# EAGLE design combined (EAGLE 6.6.0)
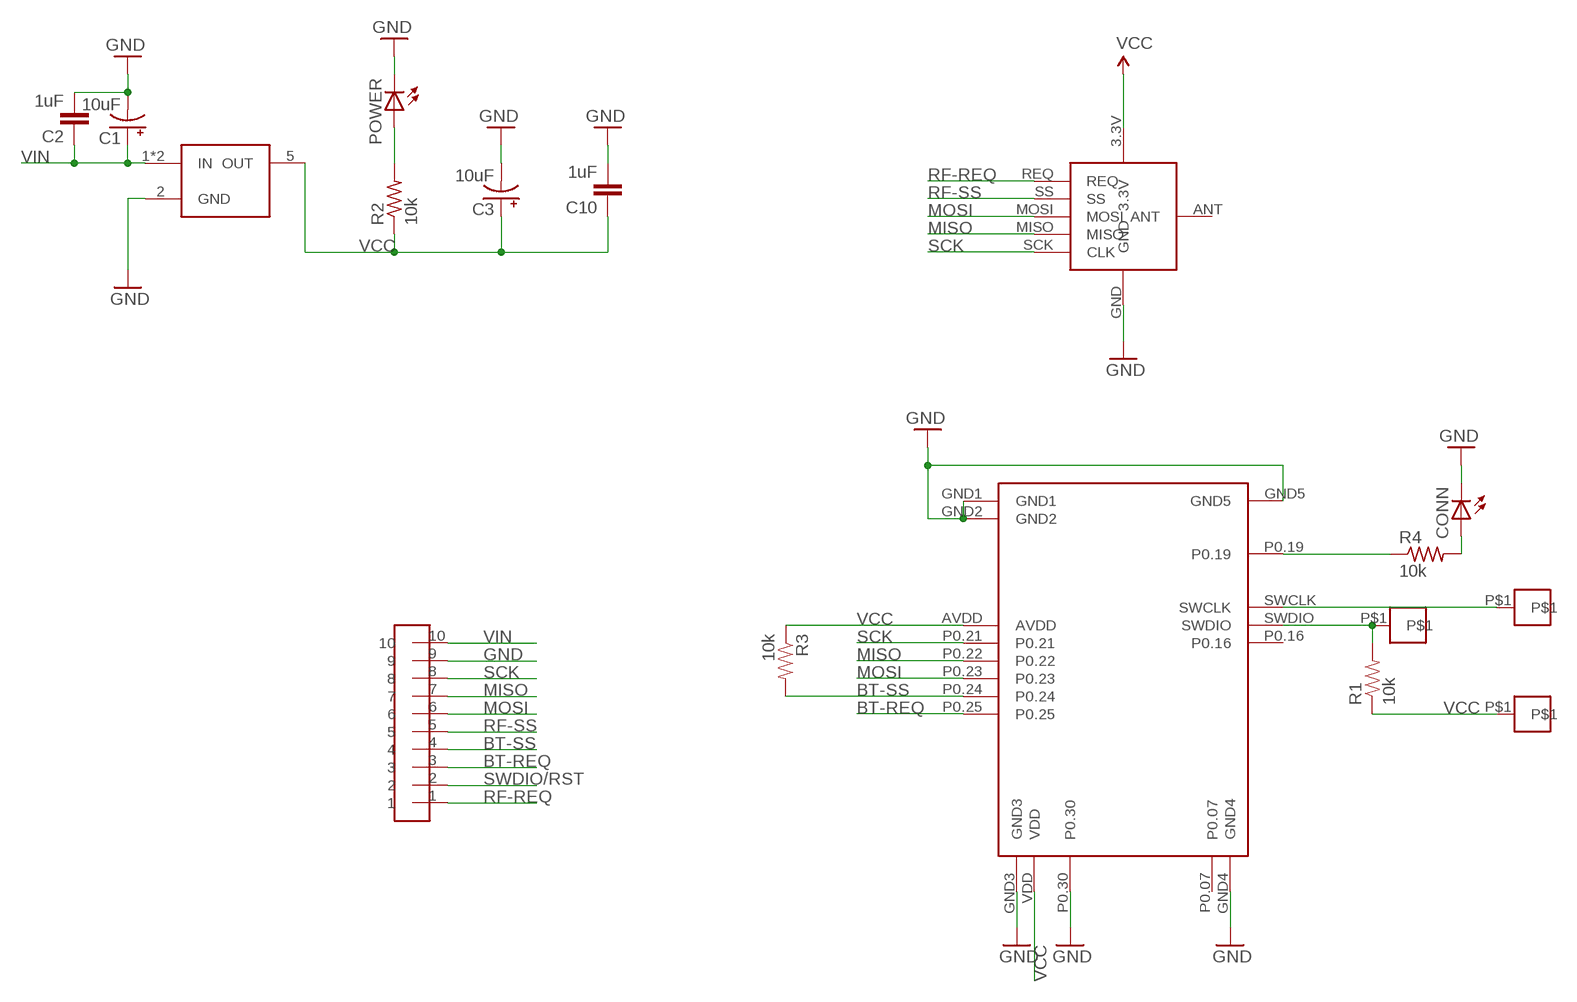
[diagram p0: schematic, sheet 1]

## Parts
C1  10uF  CAP_POL1206  [EIA3216]
C2  1uF  CAP0603-CAP  [0603-CAP]
C3  10uF  CAP_POL1206  [EIA3216]
C10  1uF  CAP0603-CAP  [0603-CAP]
CLOCK  PAD  [SMD-ROUND]
CLOCK1  PAD  [SMD-ROUND]
CONN  LEDCHIP-LED0603  [CHIP-LED0603]
POWER  LEDCHIP-LED0603  [CHIP-LED0603]
R1  10k  RESISTOR0603  [0603-RES]
R2  10k  R-US_R0603  [R0603]
R3  10k  RESISTOR0603  [0603-RES]
R4  10k  R-US_R0603  [R0603]
U$1  RFM69  [S0C-RFM69]
U$2  HEADER-10  [HEADER-10]
U$3  REGULATOR3.3V-MIC5205  [SOT23-5]
U$5  NRF51-MDBT40-SPI  [SOC-NRF51-MDBT40-SPI]
VCC  PAD  [SMD-ROUND]

## Nets
BT-REQ: U$2.3 U$5.P0.25
BT-SS: R3.2 U$2.4 U$5.P0.24
GND [vcc]: C1.C(-) C2.2 C3.C(-) C10.2 CONN.C POWER.C U$1.GND U$2.9 U$3.2(GND) U$5.GND1 U$5.GND2 U$5.GND3 U$5.GND4 U$5.GND5 U$5.P0.30
MISO: U$1.MISO U$2.7 U$5.P0.22
MOSI: U$1.MOSI U$2.6 U$5.P0.23
N$1: POWER.A R2.2
N$2: R4.1 U$5.P0.19
N$4: CONN.A R4.2
N$11: CLOCK.P$1 U$5.SWCLK
RF-REQ: U$1.REQ U$2.1
RF-SS: U$1.SS U$2.5
SCK: U$1.SCK(CLK) U$2.8 U$5.P0.21
SWDIO/RST: CLOCK1.P$1 R1.2 U$2.2 U$5.SWDIO
VCC: C3.A(+) C10.1 R1.1 R2.1 R3.1 U$1.3.3V U$3.5(OUT) U$5.AVDD U$5.VDD VCC.P$1
VIN: C1.A(+) C2.1 U$2.10 U$3.1(IN) U$3.3(IN)
Unconnected: U$1.ANT U$5.P0.07 U$5.P0.16

## Library data of the parts
C1 C3 = SparkFun-Capacitors:CAP_POL: Capacitor Polarized These are standard SMD and PTH capacitors. Normally 10uF, 47uF, and 100uF in electrolytic and tantalum varieties. Always verify the external diameter of the through hole cap, it varies with capacity, voltage, and manufacturer. The EIA devices should be standard.
C2 C10 = SparkFun:CAP: Capacitor Standard 0603 ceramic capacitor, and 0.1" leaded capacitor.
CLOCK CLOCK1 VCC = ITP_Lab:PAD
CONN POWER = adafruit:LED: LED OSRAM: - CHIPLED LG R971, LG N971, LY N971, LG Q971, LY Q971, LO R971, LY R971 LH N974, LH R974 LS Q976, LO Q976, LY Q976 LO Q996 - Hyper CHIPLED LW Q18S LB Q993, LB Q99A, LB R99A - SideLED LS A670, LO A670, LY A670, LG A670, LP A670 LB A673, LV A673, LT A673, LW A673 LH A674 LY A675 LS A676, LA A676, LO A676, LY A676, LW A676 LS A679, LY A679, LG A679 - Hyper Micro SIDELED® LS Y876, LA Y876, LO Y876, LY Y876 LT Y87S - SmartLED LW L88C, LW L88S LB L89C, LB L89S, LG L890 LS L89K, LO L89K, LY L89K LS L896, LA L896, LO L896, LY L896 - TOPLED LS T670, LO T670, LY T670, LG T670, LP T670 LSG T670, LSP T670, LSY T670, LOP T670, LYG T670 LG T671, LOG T671, LSG T671 LB T673, LV T673, LT T673, LW T673 LH T674 LS T676, LA T676, LO T676, LY T676, LB T676, LH T676, LSB T676, LW T676 LB T67C, LV T67C, LT T67C, LS T67K, LO T67K, LY T67K, LW E67C LS E67B, LA E67B, LO E67B, LY E67B, LB E67C, LV E67C, LT E67C LW T67C LS T679, LY T679, LG T679 LS T770, LO T770, LY T770, LG T770, LP T770 LB T773, LV T773, LT T773, LW T773 LH T774 LS E675, LA E675, LY E675, LS T675 LS T776, LA T776, LO T776, LY T776, LB T776 LHGB T686 LT T68C, LB T68C - Hyper Mini TOPLED® LB M676 - Mini TOPLED Santana® LG M470 LS M47K, LO M47K, LY M47K Source: http://www.osram.convergy.de/
R1 R3 = SparkFun-Resistors:RESISTOR: Resistor Basic schematic elements and footprints for 0603, 1206, and PTH resistors.
R2 R4 = adafruit:R-US_: RESISTOR, American symbol
U$1 = ITP_Lab:RFM69
U$2 = homemade-hardware:HEADER-10
U$3 = homemade-hardware:REGULATOR
U$5 = ITP_Lab:NRF51-MDBT40-SPI

## Net classes
0 default: width 0.203 mm
1 vcc: width 0.254 mm

## Board
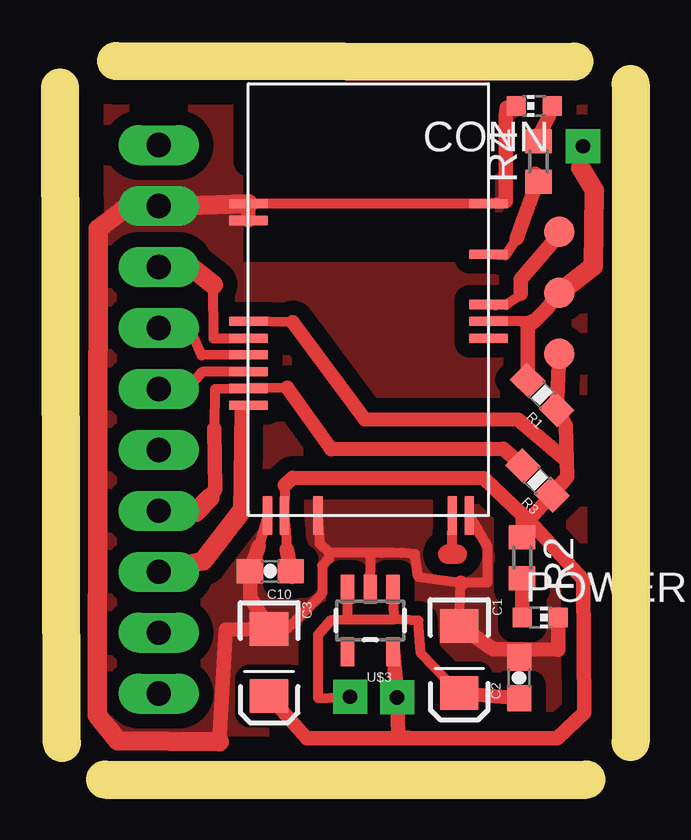
[diagram p1: board, top side]
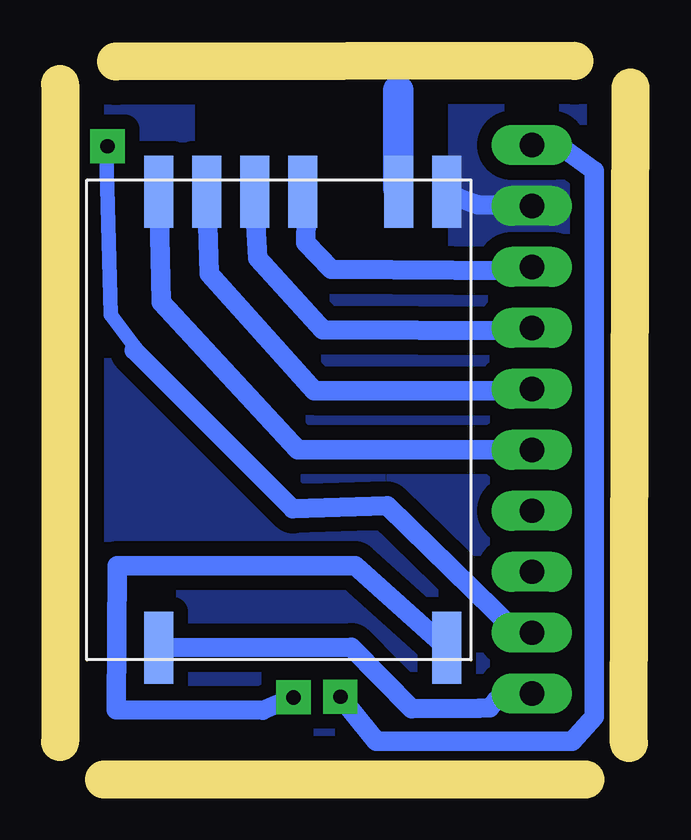
[diagram p2: board, bottom side, seen from below]

Size 23.77 x 29.95 mm. Coordinates in mm from the lower left corner, seen from the top.
Outline: 2.34,29.95 21.44,29.92
Outline: 23.77,28.98 23.77,1.57
Outline: 1.88,0 21.95,0
Outline: 0.08,1.52 0,28.83
Copper layers (1*16): Top 0.035mm / dielectric 1.5mm / Bottom 0.035mm
Design rules "default": minimum track width 10mil, minimum drill 24mil, track to track 8mil, track to pad 8mil, pad to pad 8mil, via to via 8mil, smd to smd 8mil, copper to edge 40mil, drill to drill 8mil, minimum pad ring 10mil, minimum via ring 8mil, stop-mask expansion 4mil, vias tented up to drill 0mil, thermal gap 10mil

### Footprints (pad centres in the part's own frame; a part is rotated, then mirrored left to right if it is on the bottom)
EIA3216 = smd 1.4 x 1.6: A 1.4,0; C -1.4,0
0603-CAP = smd 1.1 x 1: 1 -0.85,0; 2 0.85,0
SMD-ROUND = smd 1.27 x 1.27: P$1 0,0
CHIP-LED0603 = smd 0.8 x 0.8: A 0,-0.75; C 0,0.75
0603-RES = smd 1.1 x 1: 1 -0.85,0; 2 0.85,0
R0603 = smd 1 x 1.1: 1 -0.85,0; 2 0.85,0
S0C-RFM69 = smd 3 x 1.2: 3.3V -9.5,-7; ANT 9.5,-5; GND 9.5,-7; MISO 9.5,1; MOSI 9.5,3; REQ -9.5,5; SCK 9.5,-1; SS 9.5,5
HEADER-10 = drill 1.016 pad 1.676 long: 1 0,0; 2 0,2.54; 3 0,5.08; 4 0,7.62; 5 0,10.16; 6 0,12.7; 7 0,15.24; 8 0,17.78; 9 0,20.32; 10 0,22.86
SOT23-5 = smd 0.55 x 1.2: 1 -0.95,-1.3; 2 0,-1.3; 3 0.95,-1.3; 4 0.95,1.3; 5 -0.95,1.3
SOC-NRF51-MDBT40-SPI = smd 1.6 x 0.381: AVDD -5.08,0.48; GND1 -5.08,5.38; GND2 -5.08,4.68; GND5 4.92,5.38; P0.16 4.92,-0.22; P0.19 4.92,3.28; P0.21 -5.08,-0.22; P0.22 -5.08,-0.92; P0.23 -5.08,-1.62; P0.24 -5.08,-2.32; P0.25 -5.08,-3.02; SWCLK 4.92,1.18; SWDIO 4.92,0.48 | smd 0.381 x 1.6: GND3 -4.28,-7.62; GND4 4.12,-7.62; P0.07 3.42,-7.62; P0.30 -2.18,-7.62; VDD -3.58,-7.62

### Placement (x,y rotation side)
C1  16.64,5 270 top
C2  19.13,4.24 90 top
C3  8.71,4.88 270 top
C10  8.76,8.69 180 top
CLOCK  20.8,22.83 180 top
CLOCK1  20.8,20.29 0 top
CONN  19.76,28.07 90 top
POWER  20.02,6.76 270 top
R1  20.09,16.03 135 top
R2  19.25,9.25 270 top
R3  19.89,12.47 135 top
R4  19.94,25.76 90 top
U$1  14.66,14.99 90 bottom
U$2  4.11,3.58 0 top
U$3  12.93,6.63 180 top
U$5  12.93,18.62 0 top
VCC  20.8,17.75 180 top

### Tracks (layer width: path | path; a pad name or v marks a point on that pad's centre or on a via)
BT-REQ
  Top 0.406: 7.57,15.47 U$5.P0.25
  Top 0.61: 7.52,11.13 7.57,15.47
  Top 0.813: 7.52,11.13 5.97,9.12 U$2.3
BT-SS
  Top 0.406: 6.43,14.63 6.45,16.28 U$5.P0.24 9.47,16.33
  Top 0.61: 9.47,16.33 11.3,13.77 18.47,13.79 R3.2 | 6.43,14.63 6.48,12.09 6.25,11.73
  Top 0.813: 6.25,11.73 5.66,11.15 4.7,11.15 U$2.4
GND
  Top 0.406: U$5.GND1 U$5.GND5 18.57,24.09 | U$5.GND3 8.28,9.73 | U$5.P0.30 10.82,9.83 11.2,9.47 | 13.84,9.47 12.95,9.47 12.95,9.36 | 17.67,8.2 16.73,8.19 14.93,8.43 14.78,9.4 14.22,9.45 13.84,9.47 | 13.39,9.45 13.84,9.47 | U$3.2 12.95,9.36 | U$5.GND4 17.81,9.7 17.81,8.2 16.71,8.2 C1.C | 11.2,9.47 11.2,9.19 10.92,8.92 10.92,7.75 9.42,6.25 8.74,6.25 C3.C | 11.2,9.47 12.84,9.47 12.95,9.36
  Top 0.61: U$5.GND1 U$5.GND2 | 8.28,9.73 C10.2 7.92,7.59 C3.C 6.91,6.25 6.63,1.58 | CONN.C 18.62,27.99 18.57,27.66 18.57,24.09 | 16.71,8.2 16.73,8.19 | 5.2,23.92 U$2.9 | POWER.C 20.77,5.42 19.25,5.44 | C1.C 18.06,5.44 19.25,5.44 | C2.2 19.23,5.41 19.25,5.44
  Top 0.813: 6.63,1.58 2.41,1.63 1.55,2.69 1.6,22.96 2.62,23.72 3.58,23.93 4.37,23.93 | 4.37,23.93 4.62,23.93 | U$5.GND1 5.2,23.92 | U$2.9 4.37,23.93
  Bottom 0.61: 4.14,23.9 U$2.9
  Bottom 0.813: U$1.GND 7.09,24.21 6.38,23.95 4.14,23.9
  pour Bottom (isolate 0.61, no thermals): -0.46,0.03 -0.46,30 7.42,30 7.42,21.36 18.34,21.36 18.34,30 23.67,30 23.67,0.03
  pour Top (isolate 0.61, no thermals): -0.71,0.03 -0.71,30.51 7.42,30.51 7.42,21.36 18.34,21.36 18.34,30 23.67,30 23.67,0.03
MISO
  Top 0.406: U$5.P0.22 5.89,17.68 5.41,18.8
  Top 0.813: 5.41,18.8 U$2.7
  Bottom 0.813: U$1.MISO 15.62,23.14 15.54,21.72 12.83,18.75 4.88,18.7 | 4.88,18.7 4.77,18.69 | U$2.7 4.88,18.7
MOSI
  Top 0.406: U$5.P0.23 5.92,16.99 5.31,16.26
  Top 0.813: 5.31,16.26 U$2.6
  Bottom 0.813: U$1.MOSI 17.6,22.43 17.55,21.08 13.18,16.21 4.72,16.21 U$2.6
N$1
  Top 0.61: R2.2 POWER.A
N$2
  Top 0.406: U$5.P0.19 18.57,21.85 19.02,22.56 | 19.81,25.24 R4.1
  Top 0.61: 19.02,22.56 19.28,23.27 19.74,24.51 19.81,25.24
N$4
  Top 0.406: R4.2 19.8,26.45 | 20.37,27.62 CONN.A
  Top 0.61: 19.8,26.45 19.91,26.75 20.37,27.62
N$6
  Bottom 1.27: 9.68,24.65 9.68,28.71
N$7
  Top 0.406: 16.33,10.31 16.33,9.37
N$8
  Top 0.813: 16.15,9.4 16.56,9.4
N$11
  Top 0.406: U$5.SWCLK 18.14,19.76 18.59,19.79 19.05,20.09 19.2,20.24
  Top 0.61: CLOCK.P$1 20.6,22.48 19.2,20.85 19.2,20.24
RF-REQ
  Bottom 0.813: U$1.REQ 11.63,5.51 9.12,2.95 6.3,2.97 5.87,3 5.59,3.3 4.95,3.61 U$2.1
RF-SS
  Bottom 0.813: U$1.SS 19.56,19.89 13.87,13.74 U$2.5
SCK
  Top 0.406: U$5.P0.21 6.4,18.39 6.38,20.62
  Top 0.813: 6.38,20.62 5.64,21.21 U$2.8
  Bottom 0.813: U$1.SCK 13.51,23.39 13.54,22.38 12.47,21.26 4.8,21.21 U$2.8
SWDIO/RST  (via drill 0.6 pad 1.42)
  Top 0.406: U$5.SWDIO 19.68,19.1 19.48,19
  Top 0.61: 19.68,19.1 19.43,19.02 19.71,19.05 20.27,19.61 CLOCK1.P$1 | v21.79,26.39 21.69,25.5 | 19.48,19 R1.2
  Top 0.813: 21.69,25.5 22.25,24.56 22.22,21.39 CLOCK1.P$1
  Bottom 0.61: 20.68,17.88 20.68,18.06 21.67,19.38 21.84,26.19 v21.79,26.39
  Bottom 0.813: 20.68,17.88 14.07,11.28 10.13,11.4 6.6,7.95 4.7,6.1 U$2.2
VCC  (via drill 0.6 pad 1.42)
  Top 0.406: 9.37,12.27 U$5.VDD 9.4,10.34 9.45,9.6 | 9.7,19.05 U$5.AVDD
  Top 0.61: 9.37,12.27 9.7,12.57 17.66,12.56 19.28,11.01 | 9.7,19.05 12.7,15.01 19.1,14.99 21.12,13.3 | 9.68,8.45 C10.1 9.45,9.6 | VCC.P$1 R1.1 21.08,14.76 21.12,13.3 | U$3.5 v14.05,3.43 14.1,1.78 14.83,1.73 | 19.28,11.01 19.51,10.8 19.54,10.81 | 19.54,10.81 R3.1 21.13,12.62 21.12,13.3 | 14.83,1.73 18.26,1.73 20.73,1.73 21.84,2.79 21.79,8.32 19.54,10.81 | C3.A 10.29,1.73 14.83,1.73 | R2.1 19.28,11.01
  Bottom 0.813: 7.59,5.33 7.81,5.33 U$1.3.3V 11.48,8.92 21.39,8.92 21.44,2.92 15.32,2.9 v14.05,3.43
VIN  (via drill 0.6 pad 1.42)
  Top 0.406: 11.96,6.68 11.3,6.65 10.74,6.02 10.75,3.4 v12.09,3.45 | 11.96,6.68 13.92,6.68 | 13.92,6.68 U$3.1 | U$3.3 11.96,6.68 | C1.A 15.04,5.26 14.93,6.63 13.92,6.68
  Top 0.61: C1.A C2.1
  Bottom 0.813: v12.09,3.45 10.59,1.6 2.44,1.6 1.52,2.62 1.52,25.37 2.95,26.42 U$2.10